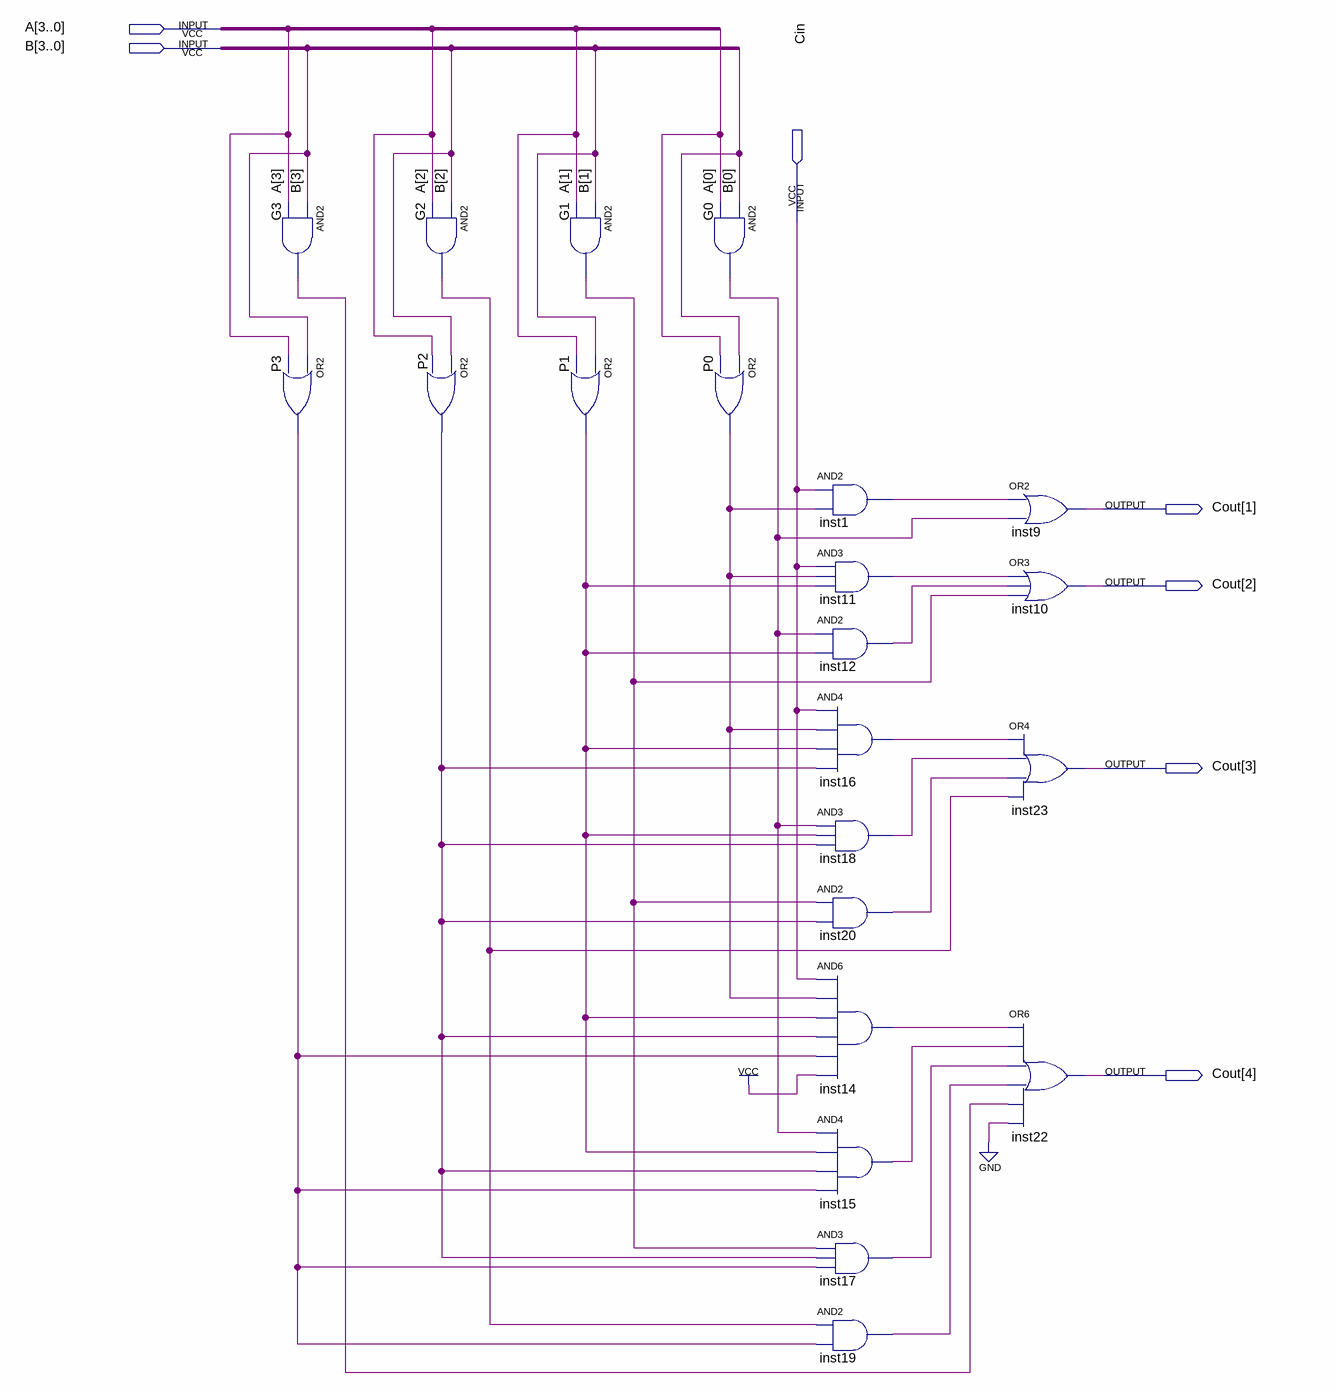
[diagram p0: schematic sheet]
// Quartus schematic carry-lookahead-unit.bdf as structural Verilog: 22 symbols, 7 pins
module \carry-lookahead-unit  (
  input  [3:0] A,
  input  [3:0] B,
  input  Cin,
  output [4:1] Cout
);

  wire G0_out, G1_out, G2_out, G3_out, inst1_out, inst11_out, inst12_out, inst14_out, inst15_out, inst16_out,
       inst17_out, inst18_out, inst19_out, inst20_out, P0_out, P1_out, P2_out, P3_out;

  and G3 (G3_out, B[3], A[3]);
  or P3 (P3_out, B[3], A[3]);
  and G2 (G2_out, B[2], A[2]);
  or P2 (P2_out, B[2], A[2]);
  and G1 (G1_out, B[1], A[1]);
  or P1 (P1_out, B[1], A[1]);
  and G0 (G0_out, B[0], A[0]);
  or P0 (P0_out, B[0], A[0]);
  and inst1 (inst1_out, Cin, P0_out);
  and inst11 (inst11_out, Cin, P0_out, P1_out);
  and inst12 (inst12_out, G0_out, P1_out);
  and inst16 (inst16_out, Cin, P0_out, P1_out, P2_out);
  and inst18 (inst18_out, G0_out, P1_out, P2_out);
  and inst20 (inst20_out, G1_out, P2_out);
  and inst14 (inst14_out, Cin, P0_out, P1_out, P2_out, P3_out, 1'b1);
  and inst15 (inst15_out, G0_out, P1_out, P2_out, P3_out);
  and inst17 (inst17_out, G1_out, P2_out, P3_out);
  and inst19 (inst19_out, G2_out, P3_out);
  or inst9 (Cout[1], inst1_out, G0_out);
  or inst10 (Cout[2], inst11_out, inst12_out, G1_out);
  or inst23 (Cout[3], inst16_out, inst18_out, inst20_out, G2_out);
  or inst22 (Cout[4], inst14_out, inst15_out, inst17_out, inst19_out, G3_out, 1'b0);
endmodule
